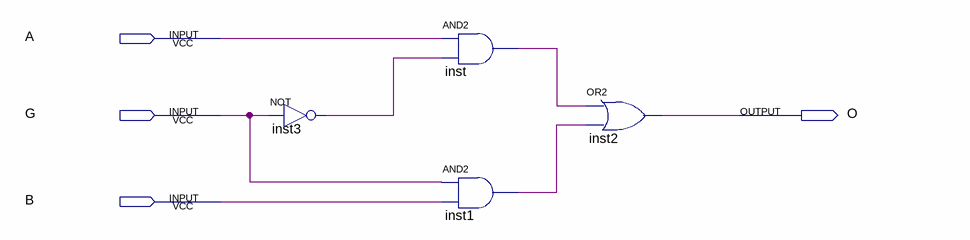
[diagram p0: schematic sheet]
// Quartus schematic mx.bdf as structural Verilog: 4 symbols, 4 pins
module mx (
  input  A,
  input  G,
  input  B,
  output O
);

  wire inst1_out, inst3_out, inst_out;

  not inst3 (inst3_out, G);
  and inst (inst_out, A, inst3_out);
  and inst1 (inst1_out, G, B);
  or inst2 (O, inst_out, inst1_out);
endmodule
